# EAGLE design strobeAT10 Lite (EAGLE 9.3.1)
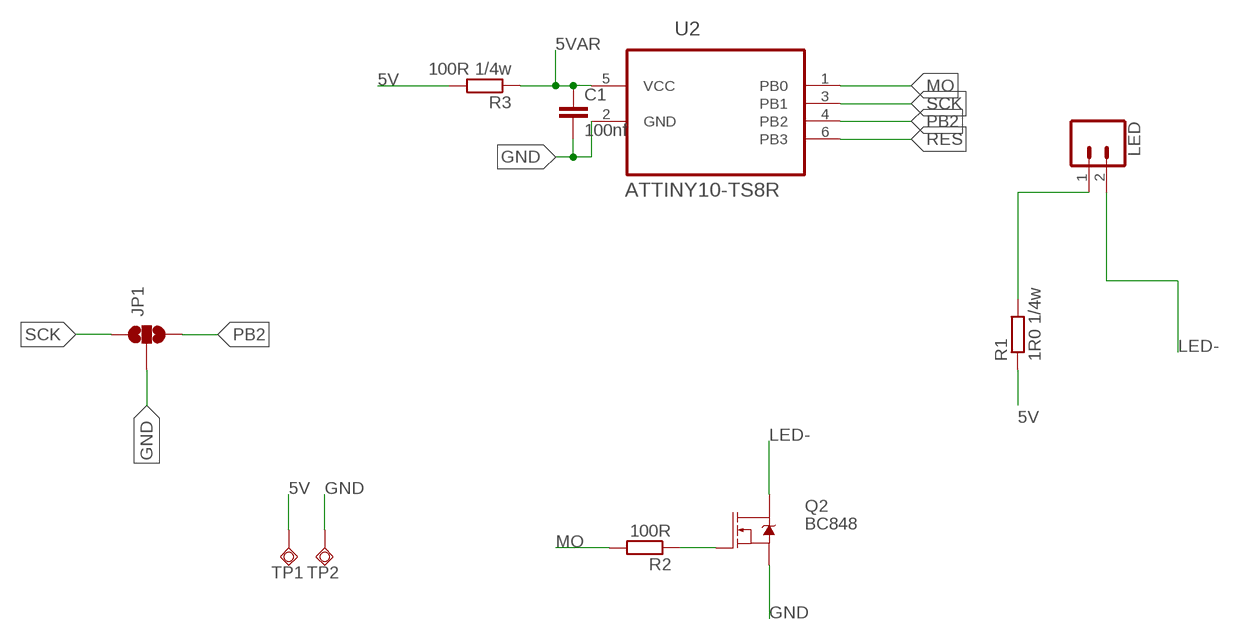
[diagram p0: schematic, sheet 1]

## Parts
C1  100nf  C-EUC0603  [C0603]
JP1  JUMPER-SMT_3_NO_SILK  [SMT-JUMPER_3_NO_SILK]
LED  CONN_02PTH3  [1X02_LONGPADS]
Q2  BC848  MOSFET-NCH-AO3404A  [SOT23-3]
R1  1R0 1/4w  R-EU_R0805  [R0805]
R2  100R  R-EU_R0603  [R0603]
R3  100R 1/4w  R-EU_R0805  [R0805]
TP1  TPSQPAD1-13Y  [P1-13Y]
TP2  TPSQPAD1-13Y  [P1-13Y]
U2  ATTINY10-TS8R  [SOT95P280X145-6N]

## Nets
5V: R1.1 R3.2 TP1.TP
5VAR: C1.1 R3.1 U2.5(VCC)
GND: C1.2 JP1.2 Q2.2(S) TP2.TP U2.2(GND)
LED-: LED.2 Q2.3(D)
MO: R2.2 U2.1(PB0)
N$1: LED.1 R1.2
N$3: Q2.1(G) R2.1
PB2: JP1.3 U2.4(PB2)
RES: U2.6(PB3)
SCK: JP1.1 U2.3(PB1)

## Library data of the parts
C1 = rcl:C-EU: CAPACITOR, European symbol; SPICEPREFIX: C
JP1 = SparkFun-Jumpers:JUMPER-SMT_3_NO: Normally open jumper This jumper has three pads in close proximity to each other. Apply solder to close the connection(s).
LED = SparkFun-Connectors:CONN_02: Multi connection point. Often used as Generic Header-pin footprint for 0.1 inch spaced/style header connections On any of the 0.1 inch spaced packages, you can populate with these: Break Away Headers - Straight <https://www.sparkfun.com/products/116> (PRT-00116) Break Away Male Headers - Right Angle <https://www.sparkfun.com/products/553> (PRT-00553) Female Headers <https://www.sparkfun.com/products/115> (PRT-00115) Break Away Headers - Machine Pin <https://www.sparkfun.com/products/117> (PRT-00117) Break Away Female Headers - Swiss Machine Pin <https://www.sparkfun.com/products/743> (PRT-00743) For SCREWTERMINALS and SPRING TERMINALS visit here: Screw Terimnals on SparkFun.com <https://www.sparkfun.com/search/results?term=Screw+Terminals> (5mm/3.5mm/2.54mm spacing) This device is also useful as a general connection point to wire up your design to another part of your project. Our various solder wires solder well into these plated through hole pads. Hook-Up Wire - Assortment (Stranded, 22 AWG) <https://www.sparkfun.com/products/11375> (PRT-11375) Hook-Up Wire - Assortment (Solid Core, 22 AWG) <https://www.sparkfun.com/products/11367> (PRT-11367) View the entire wire category on our website here <https://www.sparkfun.com/categories/141> Special notes: Molex polarized connector foot print use with: PRT-08233 with associated crimp pins and housings. 2.54_SCREWTERM for use with PRT-10571. 3.5mm Screw Terminal footprints for PRT-08084 5mm Screw Terminal footprints for use with PRT-08432
Q2 = SparkFun-DiscreteSemi:MOSFET-NCH: N-channel MOSFETs Voltage controlled devices that allow control of high current outputs. SparkFun Products: SparkFun OpenScale <https://www.sparkfun.com/products/13261> SparkFun Digital Sandbox <https://www.sparkfun.com/products/12651> SparkFun Monster Moto Shield <https://www.sparkfun.com/products/10182> SparkFun MOSFET Power Controller <https://www.sparkfun.com/products/11214>; PROD_ID: TRANS-12988; VALUE: 5.8A/30V/35mΩ
R1-R3 = resistor:R-EU_: RESISTOR, European symbol
TP1 TP2 = testpad:TPSQ: Test pad
U2 = ATTINY10-TS8R:ATTINY10-TS8R: 8-bit Microcontroller with In-System Programmable Flash; AVAILABILITY: Unavailable; DESCRIPTION: Embedded microcontroller ATTINY10-TS8R SOT 23 Microchip Technology 8-Bit 10 MHz I/O number 4; MF: Microchip; MP: ATTINY10-TS8R; PACKAGE: SOT-23-6 Microchip; PRICE: None

## Net classes
0 default: width 0.2 mm, clearance 0.2 mm

## Board
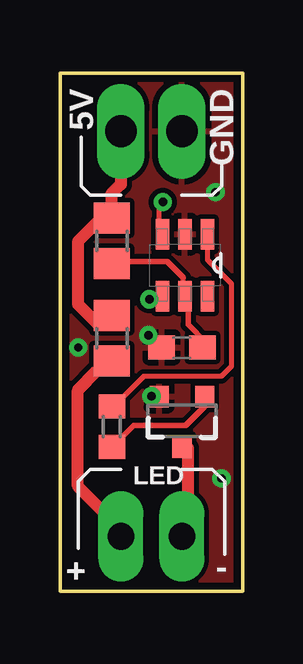
[diagram p1: board, top side]
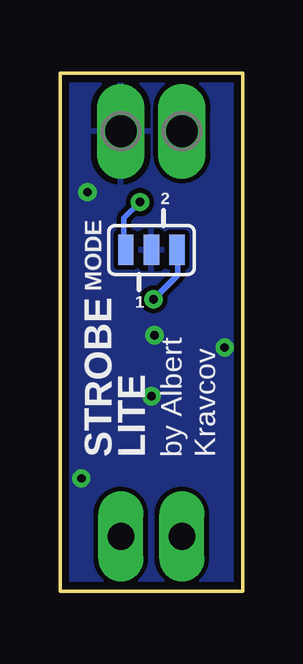
[diagram p2: board, bottom side, seen from below]

Size 7.62 x 21.59 mm. Coordinates in mm from the lower left corner, seen from the top.
Outline: 0,21.59 0,0 7.62,0 7.62,21.59 0,21.59
Copper layers (1*16): Top 0.035mm / dielectric 1.5mm / Bottom 0.035mm
Design rules "default *": minimum track width 6mil, minimum drill 0.35mm, track to track 6mil, track to pad 6mil, pad to pad 6mil, via to via 6mil, smd to smd 6mil, copper to edge 0.3mm, drill to drill 6mil, minimum pad ring 10mil, minimum via ring 8mil, stop-mask expansion 4mil, vias tented up to drill 1mm, thermal gap 10mil

### Footprints (pad centres in the part's own frame; a part is rotated, then mirrored left to right if it is on the bottom)
C0603 = smd 1.1 x 1: 1 -0.85,0; 2 0.85,0
SMT-JUMPER_3_NO_SILK = smd 0.635 x 1.27: 1 -1.067,0; 2 0,0; 3 1.067,0
1X02_LONGPADS = drill 1.118 pad 1.88 long: 1 0,0; 2 2.54,0
SOT23-3 = smd 0.8 x 0.9: 1 -0.95,-1; 2 0.95,-1; 3 0,1.1
R0805 = smd 1.3 x 1.5: 1 -0.95,0; 2 0.95,0
R0603 = smd 1 x 1.1: 1 -0.85,0; 2 0.85,0
P1-13Y = drill 1.321 pad 1.905 long: TP 0,0
SOT95P280X145-6N = smd 1.27 x 0.559: 1 -1.295,0.94; 2 -1.295,0; 3 -1.295,-0.94; 4 1.295,-0.94; 5 1.295,0; 6 1.295,0.94

### Placement (x,y rotation side)
C1  5.08,10.16 180 top
JP1  3.81,14.22 0 bottom
LED  2.54,2.29 0 top
Q2  5.08,7.11 180 top
R1  2.16,10.54 270 top
R2  2.16,6.86 90 top
R3  2.16,14.61 90 top
TP1  2.54,19.18 0 bottom
TP2  5.08,19.18 0 bottom
U2  5.21,13.59 270 top

### Tracks (layer width: path | path; a pad name or v marks a point on that pad's centre or on a via)
5V
  Top 0.2: 1.54,11.17 2.06,11.17 R1.1 | 1.54,15.37 2.1,15.37 R3.2 2.14,15.7
  Top 0.508: 1.54,11.17 0.74,11.97 0.74,14.57 1.54,15.37 | 2.14,15.7 2.14,16.57 2.54,16.97 TP1.TP
5VAR
  Top 0.2: 6.08,10.38 C1.1 | 5.34,12.22 U2.5 5.14,12.42 5.14,13.08
  Top 0.229: 6.08,10.38 5.34,11.12 5.34,12.22 | R3.1 2.26,13.75 4.47,13.75 5.14,13.08
GND  (via drill 0.35)
  other vias: 3.68,10.67 6.73,4.7 3.81,8.13 6.48,16.64 0.76,10.16
  pour Top: -10.16,22.86 17.78,22.86 17.78,-1.27 15.24,-3.81 -10.16,-3.81
  pour Bottom: -13.97,24.13 19.05,24.13 19.05,-5.08 17.78,-6.35 -13.97,-6.35
LED-
  Top 0.2: 5.34,5.96 Q2.3 | 5.34,2.44 LED.2
  Top 0.508: 5.34,2.44 5.34,5.96
MO
  Top 0.2: R2.2 2.26,7.72 3.49,8.95 6.72,8.95 7.14,9.37 7.14,12.82 6.14,13.82 6.14,14.82 U2.1
N$1
  Top 0.2: 1.54,9.17 1.96,9.17 R1.2
  Top 0.508: 1.54,9.17 0.74,8.37 0.74,4.37 2.54,2.57 LED.1
N$3
  Top 0.229: R2.1 3.06,6.91 5.25,6.91 6.03,7.7 Q2.1
PB2  (via drill 0.35)
  Top 0.2: v3.72,12.17 4.15,12.17 U2.4
  Bottom 0.2: JP1.3 2.71,14.19
  Bottom 0.229: 2.71,14.19 2.71,13.19 v3.72,12.17
SCK  (via drill 0.35)
  Top 0.2: v4.29,16.22 4.14,16.08 4.14,15.02 U2.3
  Bottom 0.2: 4.96,14.25 JP1.1
  Bottom 0.229: 4.96,14.25 4.96,15.55 v4.29,16.22

### Text on the board
tNames: 5V | GND | + | -
bNames: 2 | MODE | 1 | Kravcov | by Albert | LITE | STROBE